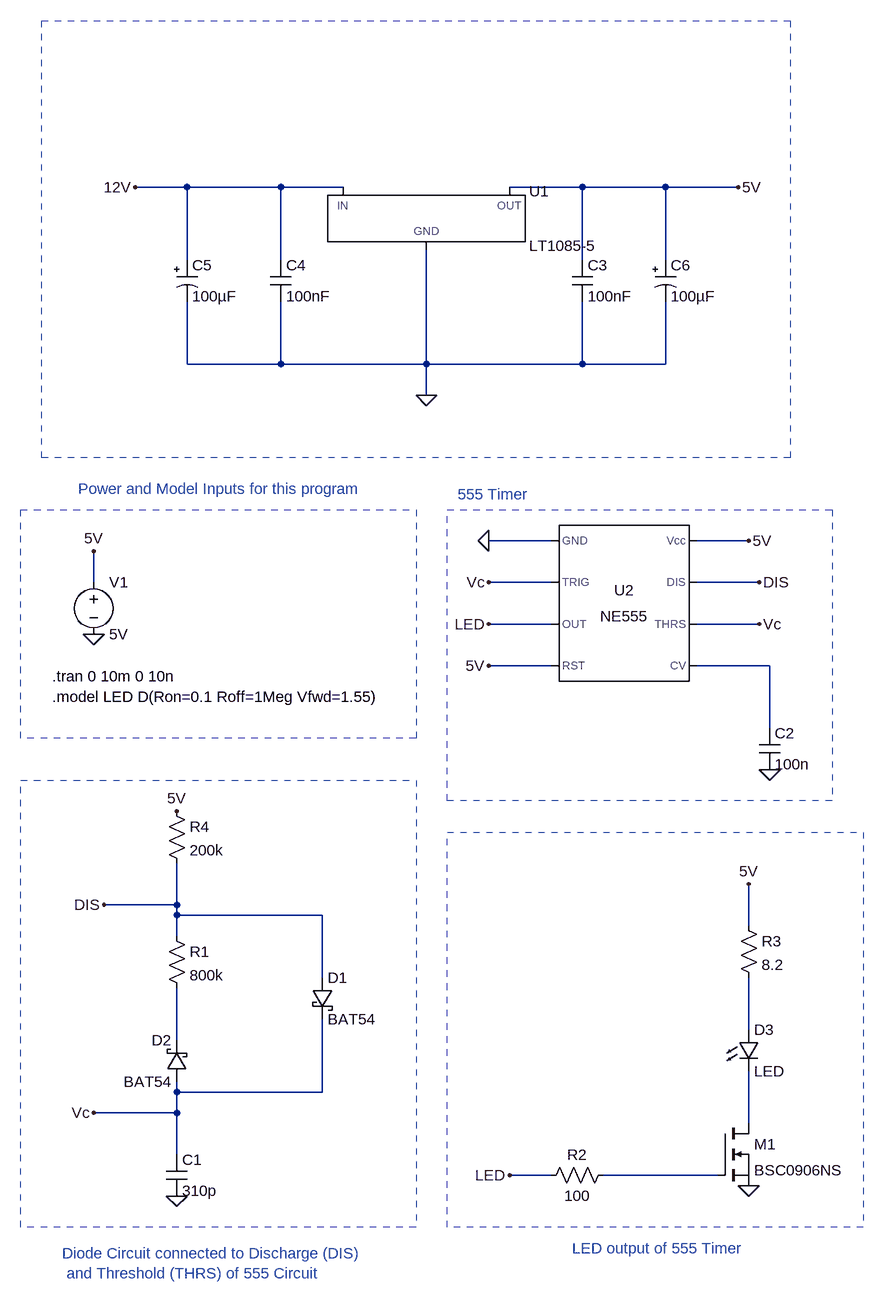
[diagram p0: schematic 555 Timer Lt Spice.asc]
555 Timer Lt Spice.asc, the LTspice schematic file:
Version 4
SHEET 1 1844 1488
WIRE -448 -400 -528 -400
WIRE -304 -400 -448 -400
WIRE -208 -400 -304 -400
WIRE 160 -400 48 -400
WIRE 288 -400 160 -400
WIRE 400 -400 288 -400
WIRE -448 -288 -448 -400
WIRE -304 -288 -304 -400
WIRE 160 -288 160 -400
WIRE 288 -288 288 -400
WIRE -448 -128 -448 -224
WIRE -304 -128 -304 -224
WIRE -304 -128 -448 -128
WIRE -80 -128 -80 -304
WIRE -80 -128 -304 -128
WIRE 160 -128 160 -224
WIRE 160 -128 -80 -128
WIRE 288 -128 288 -224
WIRE 288 -128 160 -128
WIRE -80 -80 -80 -128
WIRE 112 144 16 144
WIRE 416 144 336 144
WIRE -592 208 -592 160
WIRE 112 208 16 208
WIRE 432 208 336 208
WIRE 112 272 16 272
WIRE 432 272 336 272
WIRE 112 336 16 336
WIRE 448 336 336 336
WIRE 448 432 448 336
WIRE -464 704 -464 640
WIRE -464 704 -576 704
WIRE -464 720 -464 704
WIRE -240 720 -464 720
WIRE 416 736 416 672
WIRE -464 752 -464 720
WIRE -240 816 -240 720
WIRE 416 896 416 816
WIRE -464 912 -464 832
WIRE -464 992 -464 976
WIRE -240 992 -240 880
WIRE -240 992 -464 992
WIRE -464 1024 -464 992
WIRE -464 1024 -592 1024
WIRE 416 1040 416 960
WIRE -464 1088 -464 1024
WIRE 112 1120 48 1120
WIRE 368 1120 192 1120
FLAG 416 144 5V
FLAG 432 208 DIS
FLAG 432 272 Vc
FLAG 16 144 0
FLAG 16 272 LED
FLAG 16 208 Vc
FLAG 16 336 5V
FLAG 448 496 0
FLAG -592 288 0
FLAG -592 160 5V
FLAG -592 1024 Vc
FLAG -464 1152 0
FLAG -576 704 DIS
FLAG 48 1120 LED
FLAG 416 1136 0
FLAG 416 672 5V
FLAG -464 560 5V
FLAG -80 -80 0
FLAG -528 -400 12V
FLAG 400 -400 5V
SYMBOL NE555 224 240 R0
SYMATTR InstName U2
SYMBOL cap 432 432 R0
SYMATTR InstName C2
SYMATTR Value 100n
SYMBOL voltage -592 192 R0
SYMATTR InstName V1
SYMATTR Value 5V
SYMBOL schottky -448 976 R180
WINDOW 0 24 64 Left 2
WINDOW 3 24 0 Left 2
SYMATTR InstName D2
SYMATTR Value BAT54
SYMBOL cap -480 1088 R0
SYMATTR InstName C1
SYMATTR Value 310p
SYMBOL schottky -256 816 R0
SYMATTR InstName D1
SYMATTR Value BAT54
SYMBOL res -480 736 R0
SYMATTR InstName R1
SYMATTR Value 800k
SYMBOL res 208 1104 R90
WINDOW 0 0 56 VBottom 2
WINDOW 3 32 56 VTop 2
SYMATTR InstName R2
SYMATTR Value 100
SYMBOL nmos 368 1040 R0
SYMATTR InstName M1
SYMATTR Value BSC0906NS
SYMBOL LED 400 896 R0
SYMATTR InstName D3
SYMATTR Value LED
SYMBOL res 400 720 R0
SYMATTR InstName R3
SYMATTR Value 8.2
SYMBOL Res -480 544 R0
SYMATTR InstName R4
SYMATTR Value 200k
SYMBOL PowerProducts\\LT1085-5 -80 -400 R0
SYMATTR InstName U1
SYMBOL cap 144 -288 R0
SYMATTR InstName C3
SYMATTR Value 100nF
SYMBOL cap -320 -288 R0
SYMATTR InstName C4
SYMATTR Value 100nF
SYMBOL polcap -464 -288 R0
SYMATTR InstName C5
SYMATTR Value 100µF
SYMBOL polcap 272 -288 R0
SYMATTR InstName C6
SYMATTR Value 100µF
TEXT -656 352 Left 2 !.tran 0 10m 0 10n
TEXT -656 384 Left 2 !.model LED D(Ron=0.1 Roff=1Meg Vfwd=1.55)
TEXT -32 72 Left 2 ;555 Timer
TEXT -640 1240 Left 2 ;Diode Circuit connected to Discharge (DIS)\n and Threshold (THRS) of 555 Circuit
TEXT 144 1232 Left 2 ;LED output of 555 Timer
TEXT -616 64 Left 2 ;Power and Model Inputs for this program
RECTANGLE Normal -96 448 -704 96 2
RECTANGLE Normal -96 1200 -704 512 2
RECTANGLE Normal 544 544 -48 96 2
RECTANGLE Normal 592 1200 -48 592 2
RECTANGLE Normal 480 16 -672 -656 2

The netlist it stands for:
* 555 Timer Lt Spice.asc
XU2 0 Vc LED 5V N001 Vc DIS 5V NE555  ; pins GND TRIG OUT RST CV THRS DIS Vcc
C2 N001 0 100n
V1 5V 0 5V
D2 Vc N003 BAT54
C1 Vc 0 310p
D1 DIS Vc BAT54
R1 DIS N003 800k
R2 N005 LED 100
M1 N004 N005 0 0 BSC0906NS
D3 N002 N004 LED
R3 5V N002 8.2
R4 5V DIS 200k
XU1 0 5V 12V LT1085-5  ; pins GND OUT IN
C3 5V 0 100nF
C4 12V 0 100nF
C5 12V 0 100µF
C6 5V 0 100µF
.model D D
.lib standard.dio
.model NMOS NMOS
.model PMOS PMOS
.lib standard.mos
.tran 0 10m 0 10n
.model LED D(Ron=0.1 Roff=1Meg Vfwd=1.55)
* 555 Timer
* Diode Circuit connected to Discharge (DIS)
*  and Threshold (THRS) of 555 Circuit
* LED output of 555 Timer
* Power and Model Inputs for this program
.lib NE555.sub
.backanno
.end